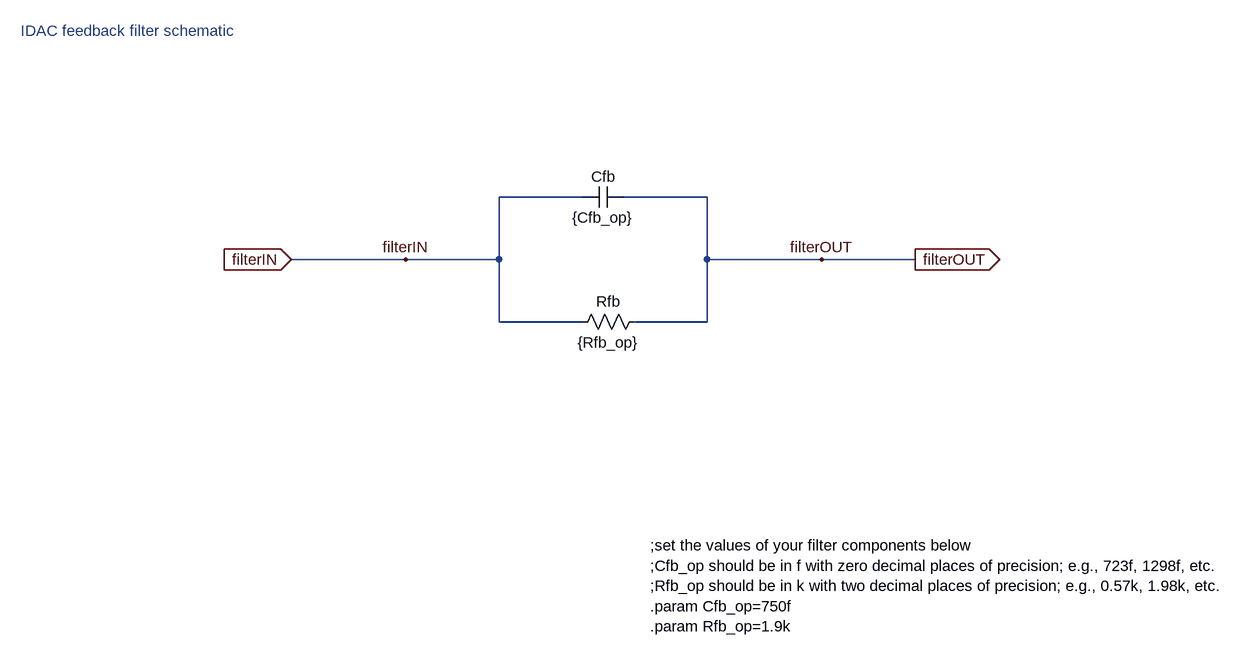
[diagram p0: schematic fdbk_filter_schematic.asc]
fdbk_filter_schematic.asc, the LTspice schematic file:
Version 4.1
SHEET 1 1756 968
WIRE 384 176 256 176
WIRE 576 176 448 176
WIRE 112 272 -64 272
WIRE 256 272 256 176
WIRE 256 272 112 272
WIRE 576 272 576 176
WIRE 752 272 576 272
WIRE 896 272 752 272
WIRE 256 368 256 272
WIRE 384 368 256 368
WIRE 576 368 576 272
WIRE 576 368 464 368
FLAG 752 272 filterOUT
FLAG 112 272 filterIN
FLAG -64 272 filterIN
IOPIN -64 272 In
FLAG 896 272 filterOUT
IOPIN 896 272 Out
SYMBOL cap 448 160 R90
WINDOW 0 0 32 VBottom 2
WINDOW 3 32 32 VTop 2
SYMATTR InstName Cfb
SYMATTR Value {Cfb_op}
SYMBOL res 480 352 R90
WINDOW 0 0 56 VBottom 2
WINDOW 3 32 56 VTop 2
SYMATTR InstName Rfb
SYMATTR Value {Rfb_op}
TEXT -480 -80 Left 2 ;IDAC feedback filter schematic
TEXT 488 712 Left 2 !;set the values of your filter components below\n;Cfb_op should be in f with zero decimal places of precision; e.g., 723f, 1298f, etc.\n;Rfb_op should be in k with two decimal places of precision; e.g., 0.57k, 1.98k, etc.\n.param Cfb_op=750f\n.param Rfb_op=1.9k

The netlist it stands for:
* fdbk_filter_schematic.asc
Cfb filterOUT filterIN {Cfb_op}
Rfb filterOUT filterIN {Rfb_op}
* IDAC feedback filter schematic
;set the values of your filter components below
;Cfb_op should be in f with zero decimal places of precision; e.g., 723f, 1298f, etc.
;Rfb_op should be in k with two decimal places of precision; e.g., 0.57k, 1.98k, etc.
.param Cfb_op=750f
.param Rfb_op=1.9k
.backanno
.end